# EasyEDA schematic power_supply_pcb.json
REV: 1.0; Date: 25-06-2022; Sheet: 1/1
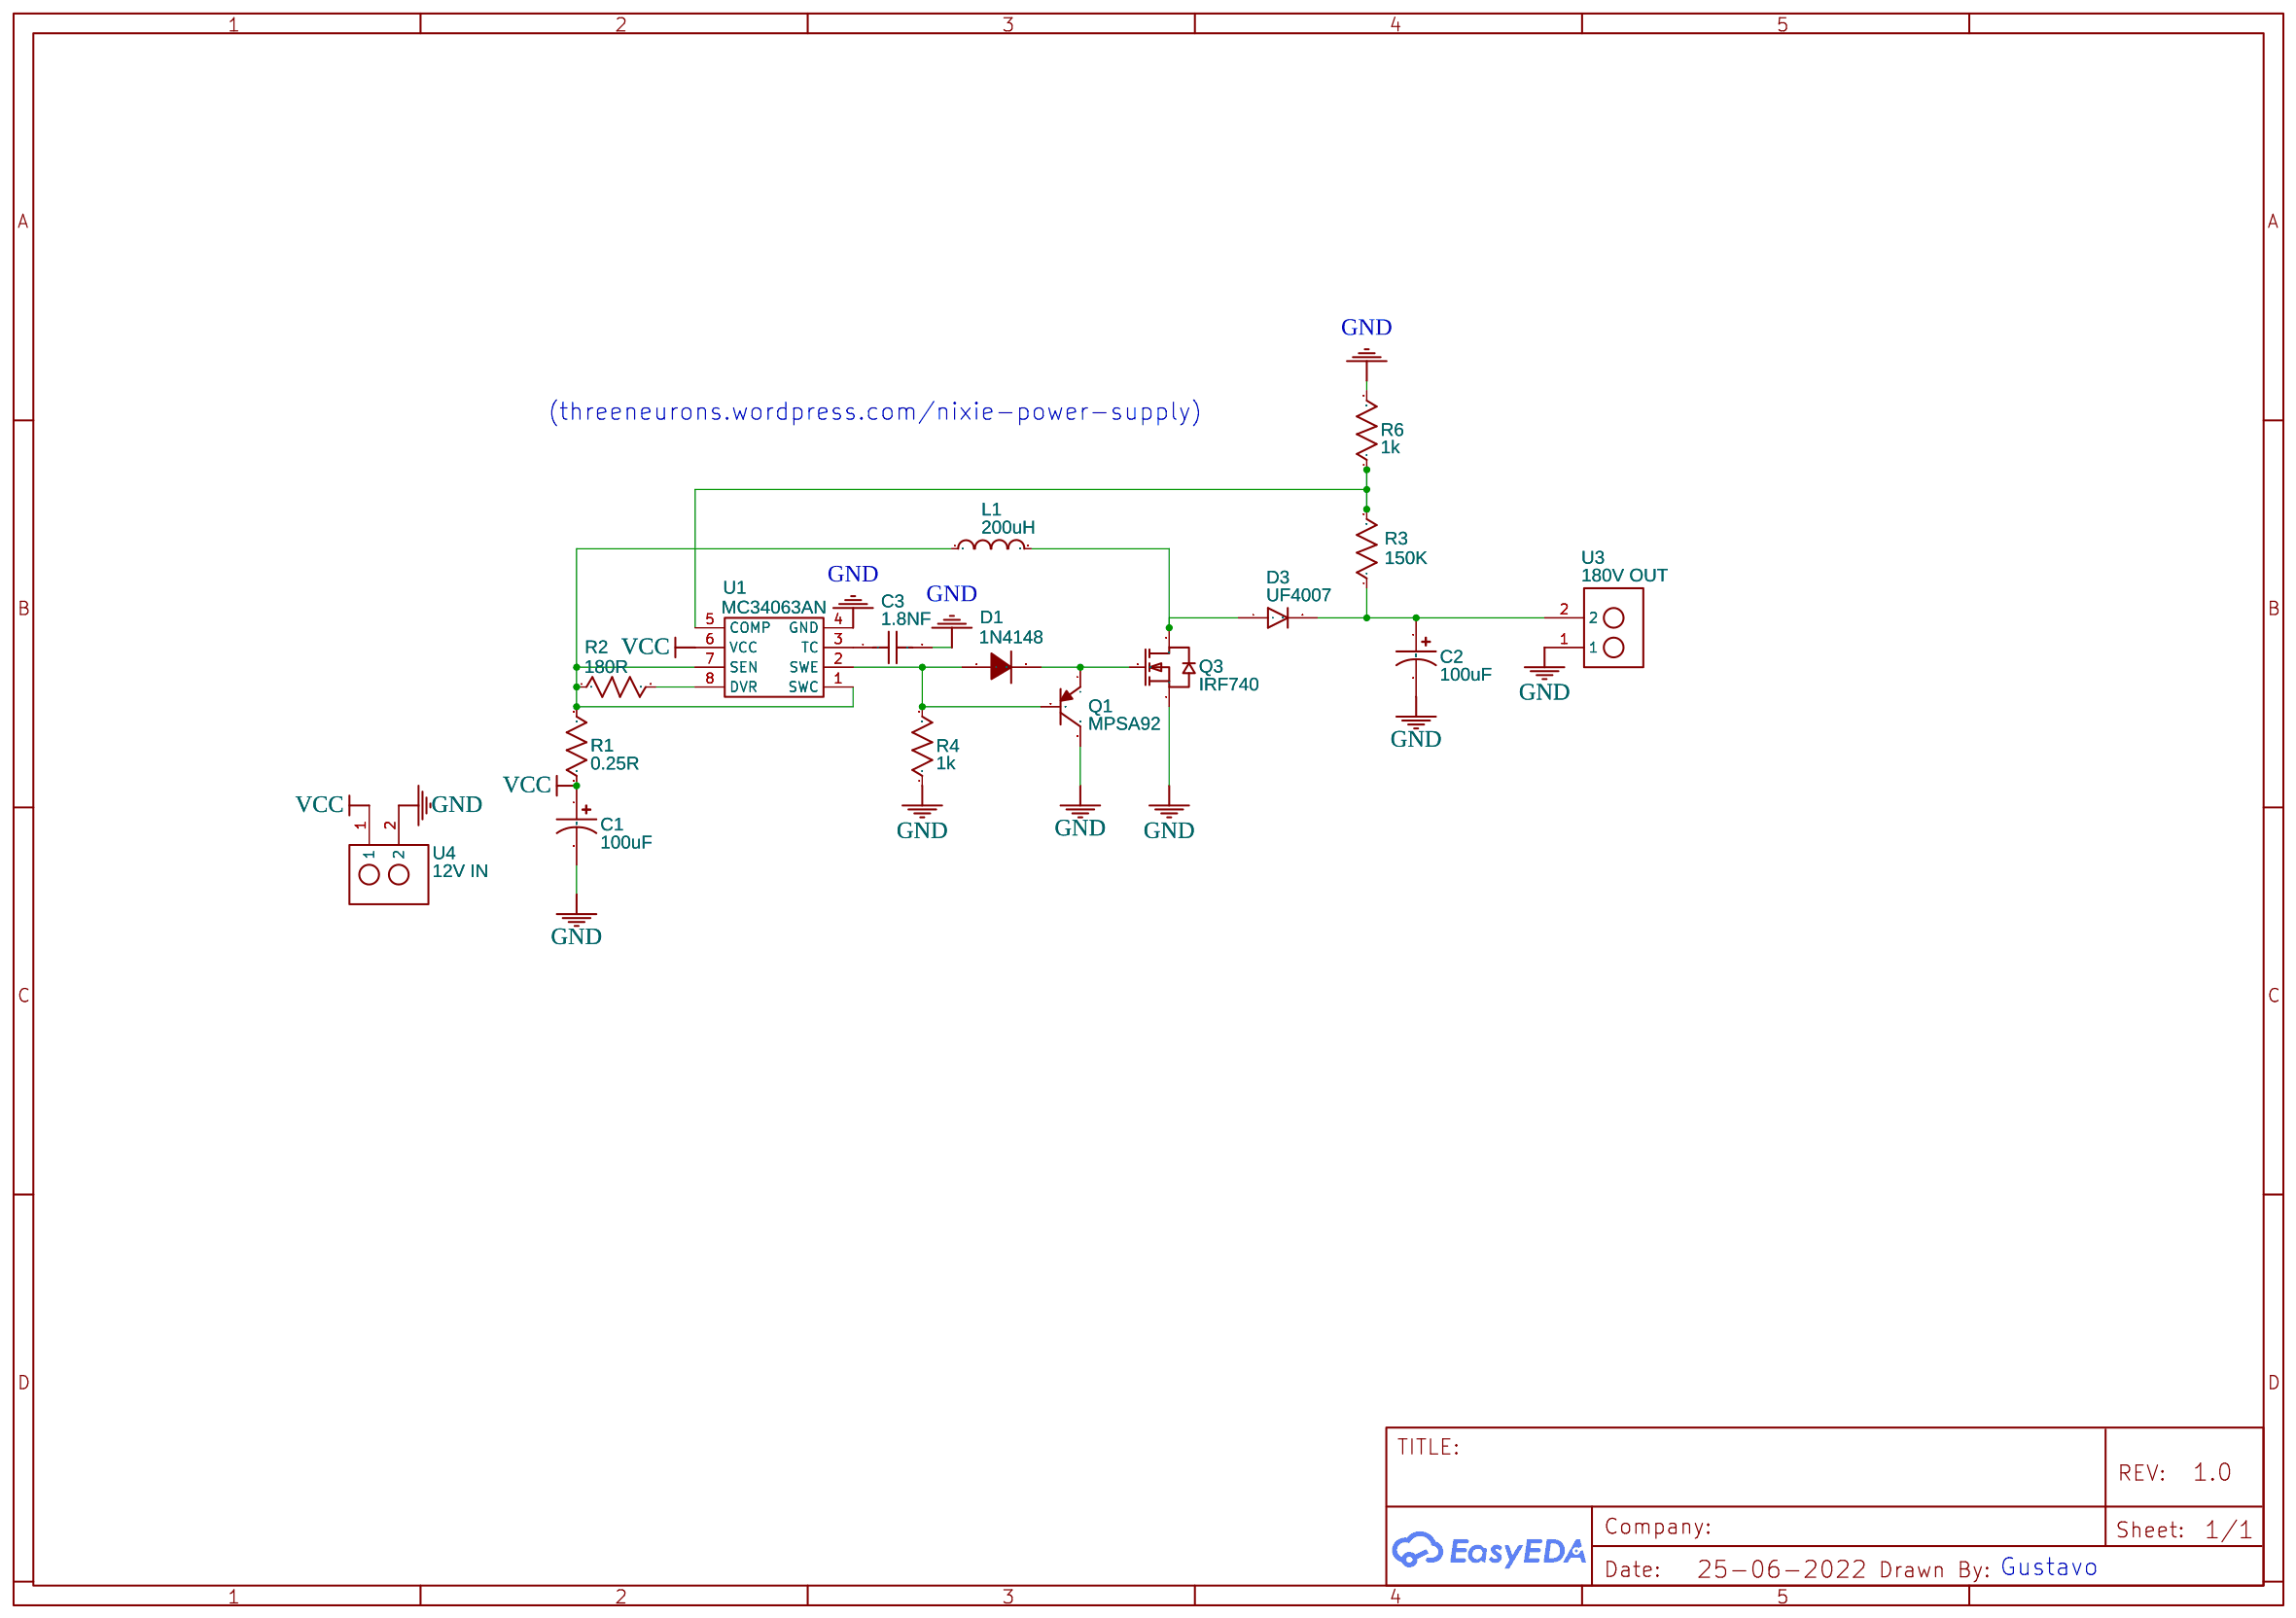
[diagram p0: schematic sheet]

## Parts
C1  100uF  [CAP-D5.0×F2.0]
C2  100uF  [CAP-D12.5×F5.0]
C3  1.8NF  [RAD-0.1]
D1  1N4148  [DO-35_BD2.0-L4.0-P8.00-D0.5-FD]
D3  UF4007  [DO-41_BD2.4-L4.7-P8.70-D0.9-FD]
L1  200uH  [L_AXIAL-0.6]
Q1  MPSA92  [TO-92-3_L5.1-W4.1-P1.27-L]
Q3  IRF740  [TO-220-3_L10.0-W4.5-P2.54-L]
R1  0.25R  [R_AXIAL-0.4]
R2  180R  [R_AXIAL-0.4]
R3  150K  [R_AXIAL-0.4]
R4  1k  [R_AXIAL-0.4]
R6  1k  [R_AXIAL-0.4]
U1  MC34063AN  [DIP-8_L9.8-W6.6-P2.54-LS7.6-BL]
U3  180V OUT  [2 PIN TERMINAL]
U4  12V IN  [2 PIN TERMINAL]

## Library data of the parts
C1 = CE_TH_D5.0×F2.0_US: Contributor: LCEDA_Lib
C2 = CE_TH_D12.5×F5.0_US: Contributor: LCEDA_Lib
C3 = C_RAD-0.1_US: Contributor: LCEDA_Lib
D1 = 1N4148: Supplier: LCSC; Manufacturer: SEMTECH; Supplier Part: C14516; JLCPCB Part Class: Extended Part
D3 = UF4007_C84067: Supplier: LCSC; Manufacturer: STARSEA; Contributor: 立创EDA官方封装库; Supplier Part: C84067; JLCPCB Part Class: Extended Part
L1 = L_AXIAL-0.6_US: Contributor: LCEDA_Lib
Q1 = MPSA92: Supplier: LCSC; Manufacturer: SEMTECH; Supplier Part: C118558; JLCPCB Part Class: Extended Part
Q3 = IRF740: Supplier: LCSC; Supplier Part: C358408; Manufacturer: Foshan Blue Rocket Elec; Contributor: LCSC; JLCPCB Part Class: Extended Part
R1-R4 R6 = R_AXIAL-0.4_US: Contributor: LCEDA_Lib
U1 = MC34063AN: Supplier: LCSC; Manufacturer: HTC; Supplier Part: C126078; JLCPCB Part Class: Extended Part
U3 U4 = 2 pin terminal: Supplier: Wemos; Contributor: Dimitrij Akimov

## Nets
GND: C1.2 C2.2 C3.2 Q1.3 Q3.3(S) R4.1 R6.2 U1.4(GND) U3.1 U4.2
VCC: C1.1 R1.1 U1.6(VCC) U4.1
Net-(C2-1): C2.1 D3.2(C) R3.1 U3.2
Net-(C3-1): C3.1 U1.3(TC)
Net-(D1-1): D1.1(A) Q1.2 R4.2 U1.2(SWE)
Net-(D1-2): D1.2(C) Q1.1 Q3.1(G)
Net-(D3-1): D3.1(A) L1.2 Q3.2(D)
Net-(L1-1): L1.1 R1.2 R2.1 U1.1(SWC) U1.7(SEN)
Net-(R2-2): R2.2 U1.8(DVR)
Net-(R3-2): R3.2 R6.1 U1.5(COMP)

## Notes on the sheet
- (threeneurons.wordpress.com/nixie-power-supply)
- Gustavo
